# Altium schematic sheet 红外.SchDoc
size A4
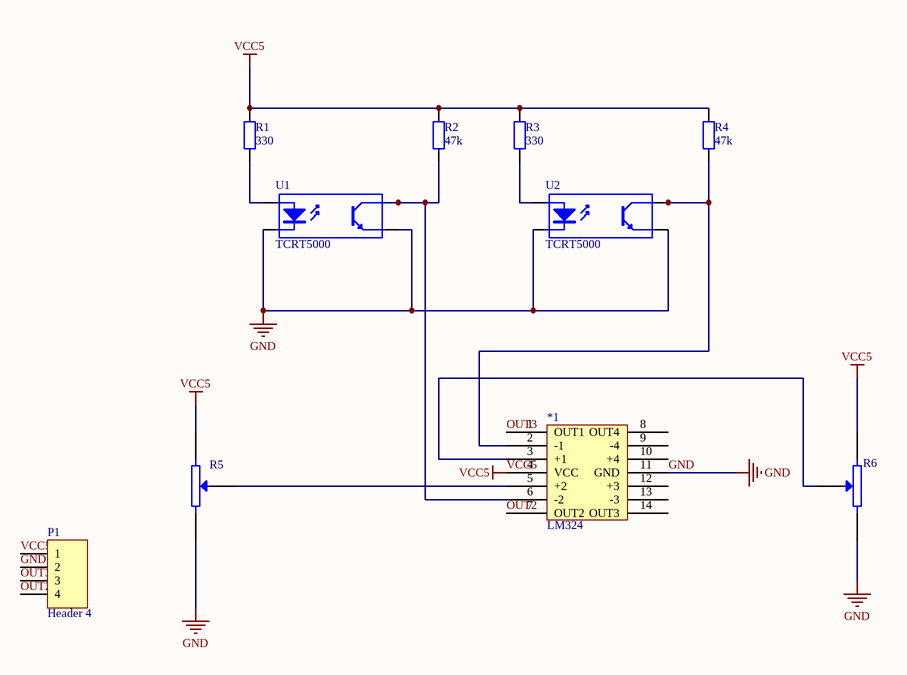
[diagram p0: 红外.SchDoc]

## Parts
*1  LM324  [DIP14]
P1  Header 4  [HDR1X4]
R1  value 330  [AXIAL-0.4]  (hidden comment: Res2)
R2  value 47k  [AXIAL-0.4]  (hidden comment: Res2)
R3  value 330  [AXIAL-0.4]  (hidden comment: Res2)
R4  value 47k  [AXIAL-0.4]  (hidden comment: Res2)
R5  1K  [VR5]  (value not drawn)
R6  1K  [VR5]  (value not drawn)
U1  TCRT5000  [DIP-4]
U2  TCRT5000  [DIP-4]

## Nets
GND: *1.11(GND) P1.2 R5.2 R6.1 U1.2(K) U1.3(E) U2.2(K) U2.3(E)
VCC5: *1.4(VCC) P1.1 R1.2 R2.2 R3.2 R4.2 R5.1 R6.2
OUT2: *1.7(OUT2) P1.4
OUT3: *1.1(OUT1) P1.3
Net*1_2: *1.2(-1) R4.1 U2.4(C)
Net*1_3: *1.3(+1) R6.3(W)
Net*1_5: *1.5(+2) R5.3(W)
Net*1_6: *1.6(-2) R2.1 U1.4(C)
NetR1_1: R1.1 U1.1(A)
NetR3_1: R3.1 U2.1(A)

Not connected (* = marked no-connect by the designer): *1 8(OUT4) 9(-4) 10(+4) 12(+3) 13(-3) 14(OUT3)

## Library data of the parts
P1 = Header 4: Header, 4-Pin; LatestRevisionDate: 17-Jul-2002; LatestRevisionNote: Re-released for DXP Platform.; Publisher: Altium Limited
R1-R4 = Res2: Resistor; Published: 8-Jun-2000; LatestRevisionDate: 17-Jul-2002; LatestRevisionNote: Re-released for DXP Platform.; PackageReference: AXIAL-0.4; Publisher: Altium Limited; PackageDescription: Axial Device, Thru-Hole; 2 Leads; 0.4 in Pin Spacing
R5 R6 = RESVR: Potentiometer
U1 U2 = Optoisolator1: 4-Pin Phototransistor Optocoupler; Published: 24-Mar-1999; LatestRevisionDate: 04-Mar-2005; LatestRevisionNote: Sch pins 3 & 4 Swapped.; DatasheetVersion: Nov-2003; PackageReference: DIP-4; Publisher: Altium Limited